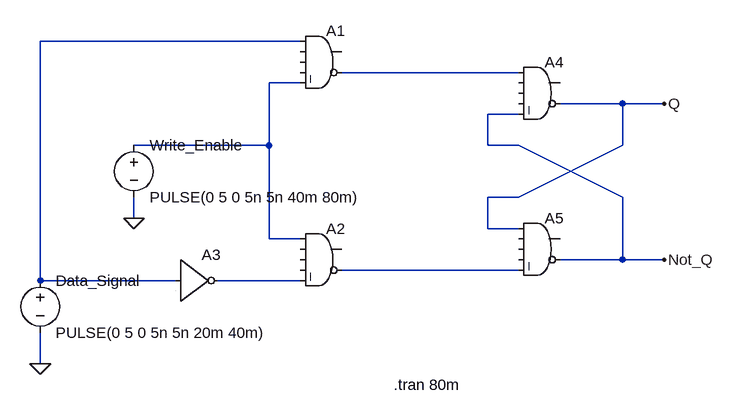
[diagram p0: schematic Draft4.asc]
Draft4.asc, the LTspice schematic file:
Version 4.1
SHEET 1 880 680
WIRE 224 -16 -176 -16
WIRE 560 32 288 32
WIRE 224 48 176 48
WIRE 720 80 624 80
WIRE 784 80 720 80
WIRE 560 96 512 96
WIRE 176 144 176 48
WIRE 176 144 -32 144
WIRE 512 144 512 96
WIRE 560 144 512 144
WIRE 720 144 720 80
WIRE 560 224 720 144
WIRE 560 224 512 224
WIRE 720 224 560 144
WIRE -32 256 -32 224
WIRE 512 272 512 224
WIRE 560 272 512 272
WIRE 176 288 176 144
WIRE 224 288 176 288
WIRE 720 320 720 224
WIRE 720 320 624 320
WIRE 784 320 720 320
WIRE 560 336 288 336
WIRE -176 352 -176 -16
WIRE 32 352 -176 352
WIRE 224 352 96 352
WIRE -176 480 -176 432
FLAG -32 256 0
FLAG -176 480 0
FLAG 784 80 Q
FLAG 784 320 Not_Q
SYMBOL voltage -176 336 R0
WINDOW 123 0 0 Left 0
WINDOW 39 0 0 Left 0
SYMATTR InstName Data_Signal
SYMATTR Value PULSE(0 5 0 5n 5n 20m 40m)
SYMBOL voltage -32 128 R0
WINDOW 123 0 0 Left 0
WINDOW 39 0 0 Left 0
SYMATTR InstName Write_Enable
SYMATTR Value PULSE(0 5 0 5n 5n 40m 80m)
SYMBOL Digital\\and 256 -48 R0
SYMATTR InstName A1
SYMBOL Digital\\and 256 256 R0
SYMATTR InstName A2
SYMBOL Digital\\inv 32 288 R0
SYMATTR InstName A3
SYMBOL Digital\\and 592 0 R0
SYMATTR InstName A4
SYMBOL Digital\\and 592 240 R0
SYMATTR InstName A5
TEXT 368 512 Left 2 !.tran 80m

The netlist it stands for:
* Draft4.asc
V§Data_Signal N001 0 PULSE(0 5 0 5n 5n 20m 40m)
V§Write_Enable N003 0 PULSE(0 5 0 5n 5n 40m 80m)
A1 N001 0 0 0 N003 N002 0 0 AND
A2 N003 0 0 0 N005 N004 0 0 AND
A3 N001 0 0 0 0 N005 0 0 BUF
A4 N002 0 0 0 Not_Q Q 0 0 AND
A5 Q 0 0 0 N004 Not_Q 0 0 AND
.tran 80m
.backanno
.end